# EAGLE schematic motor_controller (EAGLE 9.6.2)
AUTHOR: Mike Schmidt; GENERATION: pasta; TITLE: Motor Controller; VERSION: 05

## Sheet 1 of 4: Connectors and Input Filtering
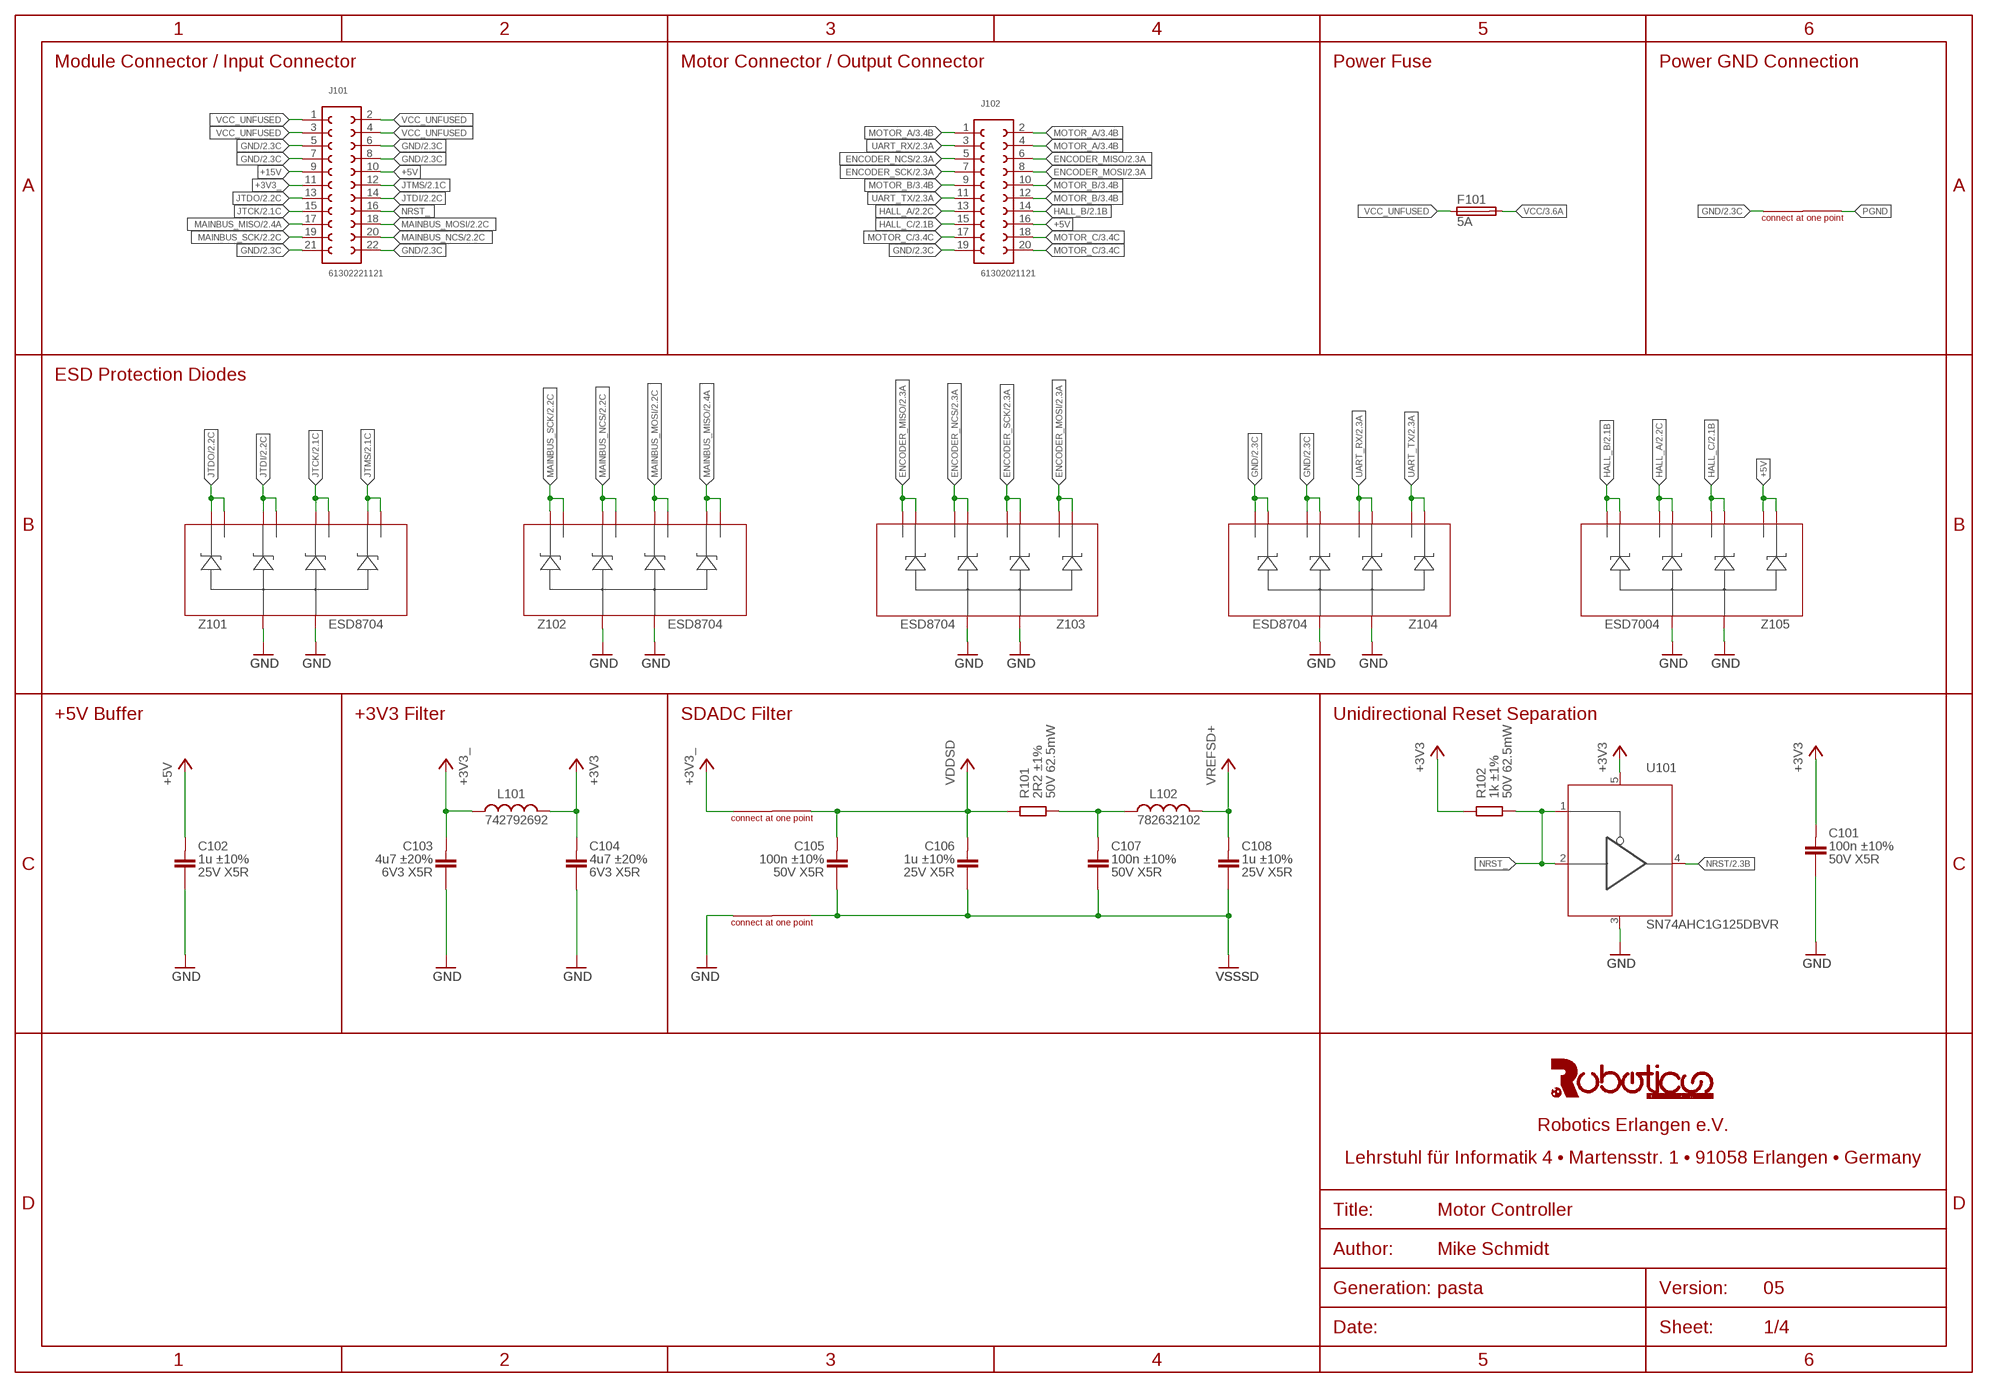
[diagram p0: schematic, sheet 1]

### Parts
C101  100n ±10% 50V X5R  C(100NF,50V,0402)  [C0402]
C102  1u ±10% 25V X5R  C(1.0UF,25V,0402)  [C0402]
C103  4u7 ±20% 6V3 X5R  C(4.7UF,6.3V,0603)  [C0603]
C104  4u7 ±20% 6V3 X5R  C(4.7UF,6.3V,0603)  [C0603]
C105  100n ±10% 50V X5R  C(100NF,50V,0402)  [C0402]
C106  1u ±10% 25V X5R  C(1.0UF,25V,0402)  [C0402]
C107  100n ±10% 50V X5R  C(100NF,50V,0402)  [C0402]
C108  1u ±10% 25V X5R  C(1.0UF,25V,0402)  [C0402]
F101  5A  0157005.DRT  [157T]
J101  61302221121  [HDRV22W64P254_2X11_2794X508X854B]
J102  61302021121  [61302021121]
L101  742792692  [WE-CBF_0603(W=2.6)]
L102  782632102  [WE-CBF_0603(W=2.6)]
R101  2R2 ±1% 50V 62.5mW  R(2.2R,50V,0.0625W,0402)  [R0402]
R102  1k ±1% 50V 62.5mW  R(1.0K,50V,0.0625W,0402)  [R0402]
SHORT101  SHORT4.35  [SHORT4.35]
SHORT102  SHORT2.4  [SHORT2.4]
SHORT103  SHORT2.4  [SHORT2.4]
U101  SN74AHC1G125DBVR  [SOT23-5]
Z101  ESD8704  [UDFN10]
Z102  ESD8704  [UDFN10]
Z103  ESD8704  [UDFN10]
Z104  ESD8704  [UDFN10]
Z105  ESD7004  [UDFN10]

### Nets
+3V3: C101.1 C104.1 L101.2 R102.1 U101.5(VCC) ; also sheet 2,3
+3V3_: C103.1 J101.11 L101.1 SHORT102.P2
+5V: C102.1 J101.10 J102.16 Z105.1(C1) Z105.10(D1)
+15V: J101.9
ENCODER_MISO: J102.6 Z103.5(C4) Z103.6(D4) ; also sheet 2
ENCODER_MOSI: J102.8 Z103.1(C1) Z103.10(D1) ; also sheet 2
ENCODER_NCS: J102.5 Z103.4(C3) Z103.7(D3) ; also sheet 2
ENCODER_SCK: J102.7 Z103.2(C2) Z103.9(D2) ; also sheet 2
GND: C101.2 C102.2 C103.2 C104.2 J101.5 J101.6 J101.7 J101.8 J101.21 J101.22 J102.19 SHORT101.P2 SHORT103.P2 U101.3(GND) Z101.3(A) Z101.8(A) Z102.3(A) Z102.8(A) Z103.3(A) Z103.8(A) Z104.3(A) Z104.4(C3) Z104.5(C4) Z104.6(D4) Z104.7(D3) Z104.8(A) Z105.3(A) Z105.8(A) ; also sheet 2,3
HALL_A: J102.13 Z105.4(C3) Z105.7(D3) ; also sheet 2,3
HALL_B: J102.14 Z105.5(C4) Z105.6(D4) ; also sheet 2,3
HALL_C: J102.15 Z105.2(C2) Z105.9(D2) ; also sheet 2,3
JTCK: J101.15 Z101.4(C3) Z101.7(D3) ; also sheet 2
JTDI: J101.14 Z101.2(C2) Z101.9(D2) ; also sheet 2
JTDO: J101.13 Z101.1(C1) Z101.10(D1) ; also sheet 2
JTMS: J101.12 Z101.5(C4) Z101.6(D4) ; also sheet 2
MAINBUS_MISO: J101.17 Z102.5(C4) Z102.6(D4) ; also sheet 2
MAINBUS_MOSI: J101.18 Z102.4(C3) Z102.7(D3) ; also sheet 2
MAINBUS_NCS: J101.20 Z102.2(C2) Z102.9(D2) ; also sheet 2
MAINBUS_SCK: J101.19 Z102.1(C1) Z102.10(D1) ; also sheet 2
MOTOR_A: J102.1 J102.2 J102.4 ; also sheet 3,4
MOTOR_B: J102.9 J102.10 J102.12 ; also sheet 3,4
MOTOR_C: J102.17 J102.18 J102.20 ; also sheet 3,4
N$2: C107.1 L102.1 R101.2
NRST: U101.4(O) ; also sheet 2
NRST_: J101.16 R102.2 U101.1(OE) U101.2(I)
PGND: SHORT101.P1 ; also sheet 3,4
UART_RX: J102.3 Z104.2(C2) Z104.9(D2) ; also sheet 2
UART_TX: J102.11 Z104.1(C1) Z104.10(D1) ; also sheet 2
VCC: F101.2 ; also sheet 3
VCC_UNFUSED: F101.1 J101.1 J101.2 J101.3 J101.4
VDDSD: C105.1 C106.1 R101.1 SHORT102.P1 ; also sheet 2,3
VREFSD+: C108.1 L102.2 ; also sheet 2
VSSSD: C105.2 C106.2 C107.2 C108.2 SHORT103.P1 ; also sheet 2,3

### Notes on the sheet
- Module Connector / Input Connector | Motor Connector / Output Connector | Power Fuse | Power GND Connection
- ESD Protection Diodes
- +5V Buffer | +3V3 Filter | SDADC Filter | Unidirectional Reset Separation

## Sheet 2 of 4: CPU and Logic
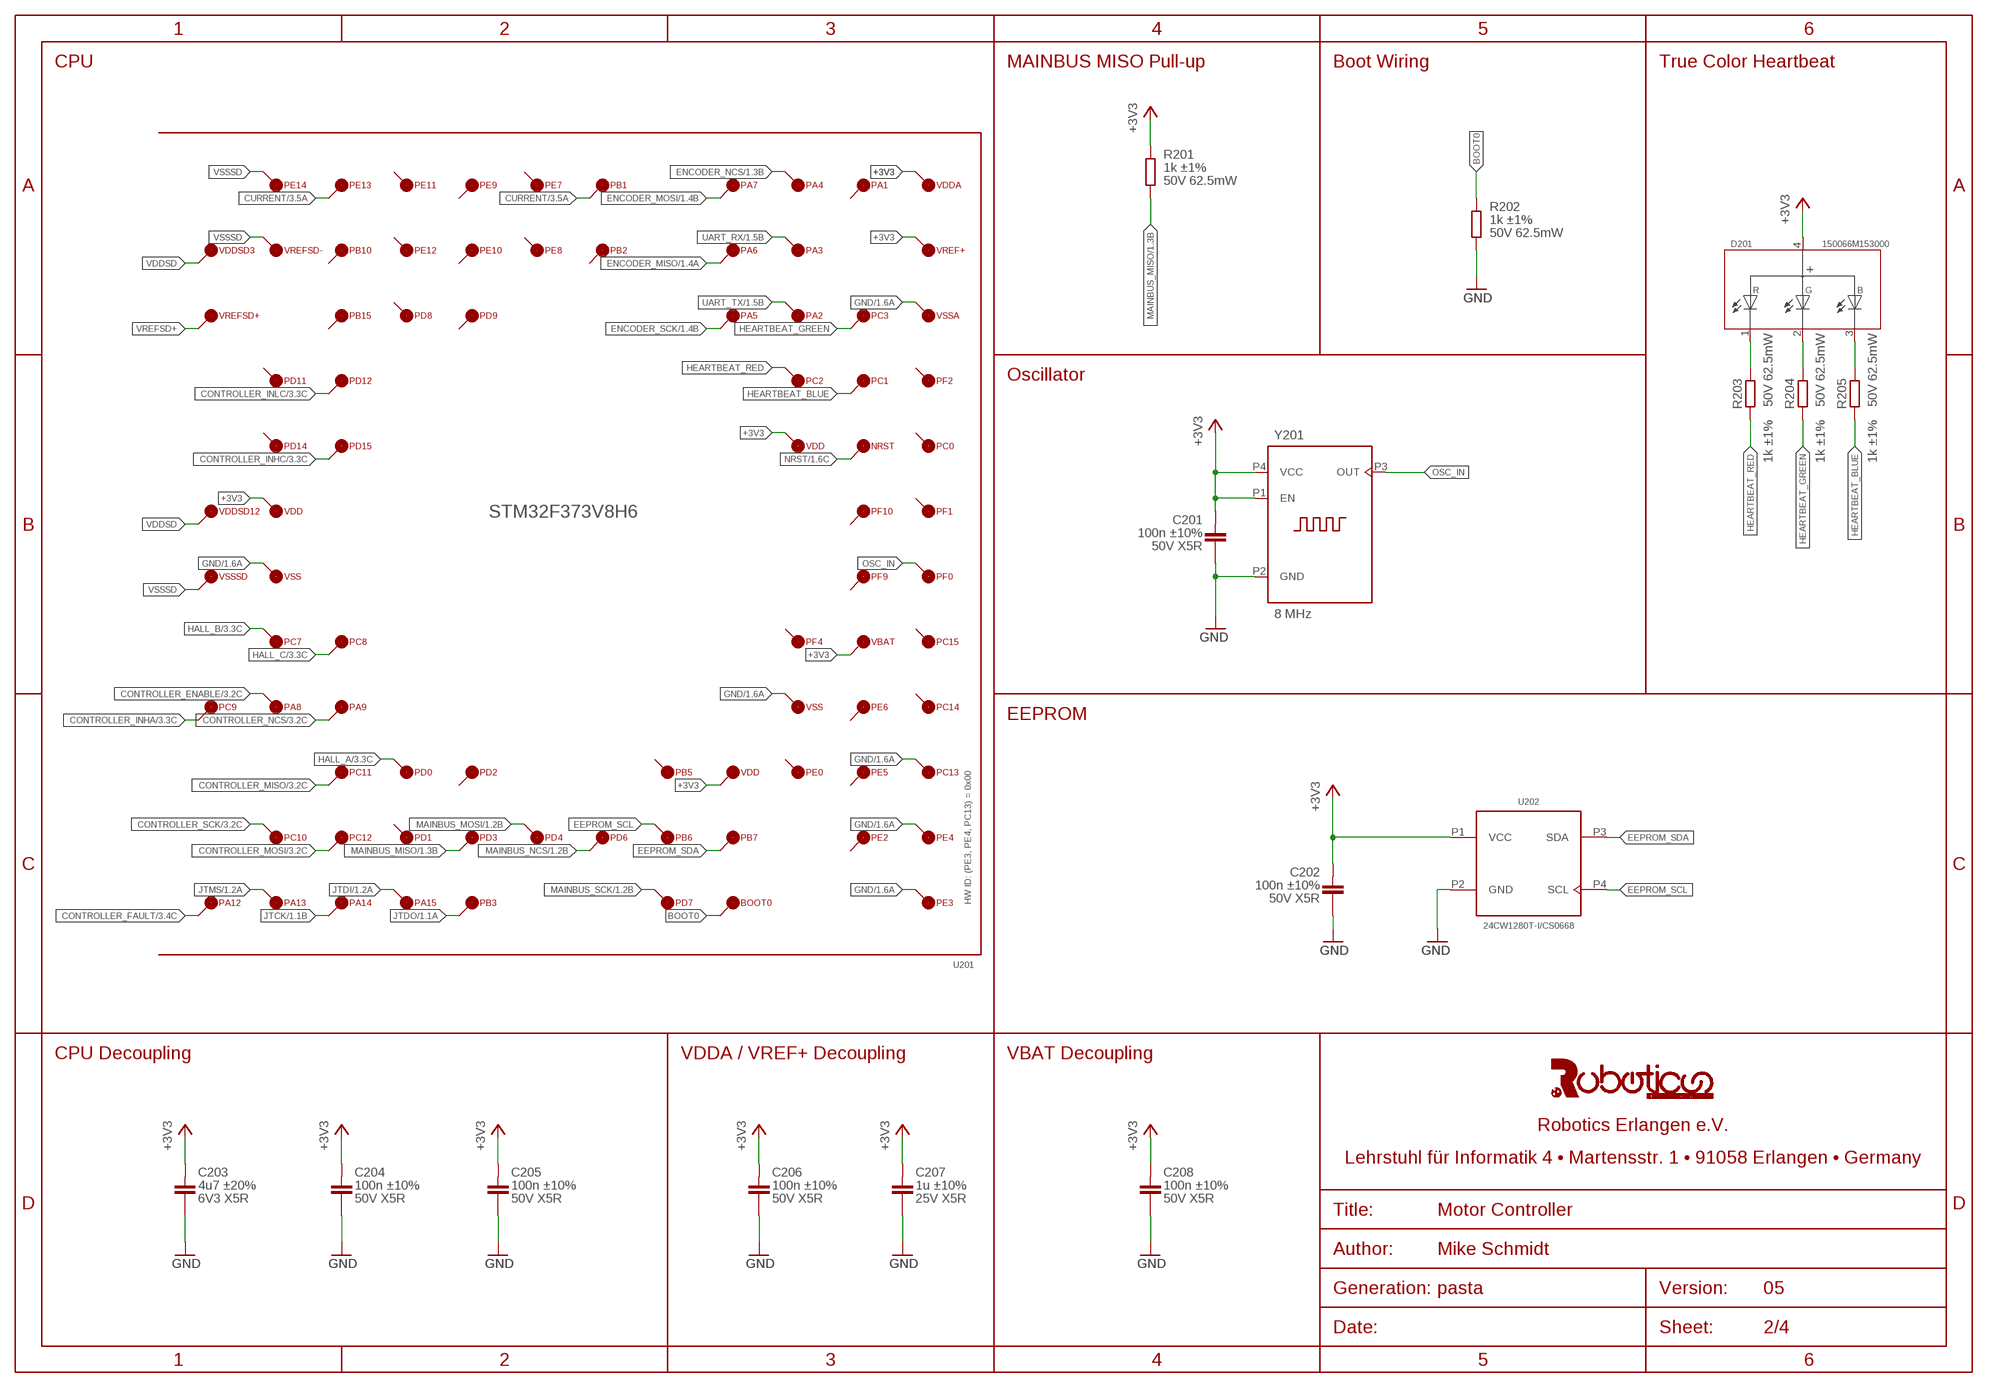
[diagram p1: schematic, sheet 2]

### Parts
C201  100n ±10% 50V X5R  C(100NF,50V,0402)  [C0402]
C202  100n ±10% 50V X5R  C(100NF,50V,0402)  [C0402]
C203  4u7 ±20% 6V3 X5R  C(4.7UF,6.3V,0603)  [C0603]
C204  100n ±10% 50V X5R  C(100NF,50V,0402)  [C0402]
C205  100n ±10% 50V X5R  C(100NF,50V,0402)  [C0402]
C206  100n ±10% 50V X5R  C(100NF,50V,0402)  [C0402]
C207  1u ±10% 25V X5R  C(1.0UF,25V,0402)  [C0402]
C208  100n ±10% 50V X5R  C(100NF,50V,0402)  [C0402]
D201  150066M153000  [WL-SFCX_0606]
R201  1k ±1% 50V 62.5mW  R(1.0K,50V,0.0625W,0402)  [R0402]
R202  1k ±1% 50V 62.5mW  R(1.0K,50V,0.0625W,0402)  [R0402]
R203  1k ±1% 50V 62.5mW  R(1.0K,50V,0.0625W,0402)  [R0402]
R204  1k ±1% 50V 62.5mW  R(1.0K,50V,0.0625W,0402)  [R0402]
R205  1k ±1% 50V 62.5mW  R(1.0K,50V,0.0625W,0402)  [R0402]
U201  STM32F373V8H6  [STM32F373V8H6]
U202  24CW1280T-I/CS0668  [CS0-4]
Y201  8 MHz  830207192009  [830207192009]

### Nets
+3V3: C201.1 C202.1 C203.1 C204.1 C205.1 C206.1 C207.1 C208.1 D201.4 R201.2 U201.VBAT U201.VDD@1(VDD) U201.VDD@2(VDD) U201.VDD@3(VDD) U201.VDDA U201.VREF+ U202.P1(VCC) Y201.P1(EN) Y201.P4(VCC) ; also sheet 1,3
BOOT0: R202.2 U201.BOOT0
CONTROLLER_ENABLE: U201.PA8 ; also sheet 3
CONTROLLER_FAULT: U201.PA12 ; also sheet 3
CONTROLLER_INHA: U201.PC9 ; also sheet 3
CONTROLLER_INHC: U201.PD15 ; also sheet 3
CONTROLLER_INLC: U201.PD12 ; also sheet 3
CONTROLLER_MISO: U201.PC11 ; also sheet 3
CONTROLLER_MOSI: U201.PC12 ; also sheet 3
CONTROLLER_NCS: U201.PA9 ; also sheet 3
CONTROLLER_SCK: U201.PC10 ; also sheet 3
CURRENT: U201.PB1 U201.PE13 ; also sheet 3
EEPROM_SCL: U201.PB6 U202.P4(SCL)
EEPROM_SDA: U201.PB7 U202.P3(SDA)
ENCODER_MISO: U201.PA6 ; also sheet 1
ENCODER_MOSI: U201.PA7 ; also sheet 1
ENCODER_NCS: U201.PA4 ; also sheet 1
ENCODER_SCK: U201.PA5 ; also sheet 1
GND: C201.2 C202.2 C203.2 C204.2 C205.2 C206.2 C207.2 C208.2 R202.1 U201.PC13 U201.PE3 U201.PE4 U201.VSS@1(VSS) U201.VSS@3(VSS) U201.VSSA U202.P2(GND) Y201.P2(GND) ; also sheet 1,3
HALL_A: U201.PD0 ; also sheet 1,3
HALL_B: U201.PC7 ; also sheet 1,3
HALL_C: U201.PC8 ; also sheet 1,3
HEARTBEAT_BLUE: R205.2 U201.PC1
HEARTBEAT_GREEN: R204.2 U201.PC3
HEARTBEAT_RED: R203.2 U201.PC2
JTCK: U201.PA14 ; also sheet 1
JTDI: U201.PA15 ; also sheet 1
JTDO: U201.PB3 ; also sheet 1
JTMS: U201.PA13 ; also sheet 1
MAINBUS_MISO: R201.1 U201.PD3 ; also sheet 1
MAINBUS_MOSI: U201.PD4 ; also sheet 1
MAINBUS_NCS: U201.PD6 ; also sheet 1
MAINBUS_SCK: U201.PD7 ; also sheet 1
N$10: D201.1(R) R203.1
N$21: D201.2(G) R204.1
N$23: D201.3(B) R205.1
NRST: U201.NRST ; also sheet 1
OSC_IN: U201.PF0 Y201.P3(OUT)
UART_RX: U201.PA3 ; also sheet 1
UART_TX: U201.PA2 ; also sheet 1
VDDSD: U201.VDDSD3 U201.VDDSD12 ; also sheet 1,3
VREFSD+: U201.VREFSD+ ; also sheet 1
VSSSD: U201.PE14 U201.VREFSD- U201.VSSSD ; also sheet 1,3
Unconnected: U201.PA1 U201.PB2 U201.PB5 U201.PB10 U201.PB15 U201.PC0 U201.PC14 U201.PC15 U201.PD1 U201.PD2 U201.PD8 U201.PD9 U201.PD11 U201.PD14 U201.PE0 U201.PE2 U201.PE5 U201.PE6 U201.PE7 U201.PE8 U201.PE9 U201.PE10 U201.PE11 U201.PE12 U201.PF1 U201.PF2 U201.PF4 U201.PF9 U201.PF10

### Notes on the sheet
- CPU | MAINBUS MISO Pull-up | Boot Wiring | True Color Heartbeat
- Oscillator
- EEPROM
- HW ID: (PE3, PE4, PC13) = 0x00
- CPU Decoupling | VDDA / VREF+ Decoupling | VBAT Decoupling

## Sheet 3 of 4: Motor Controller & Current Sense
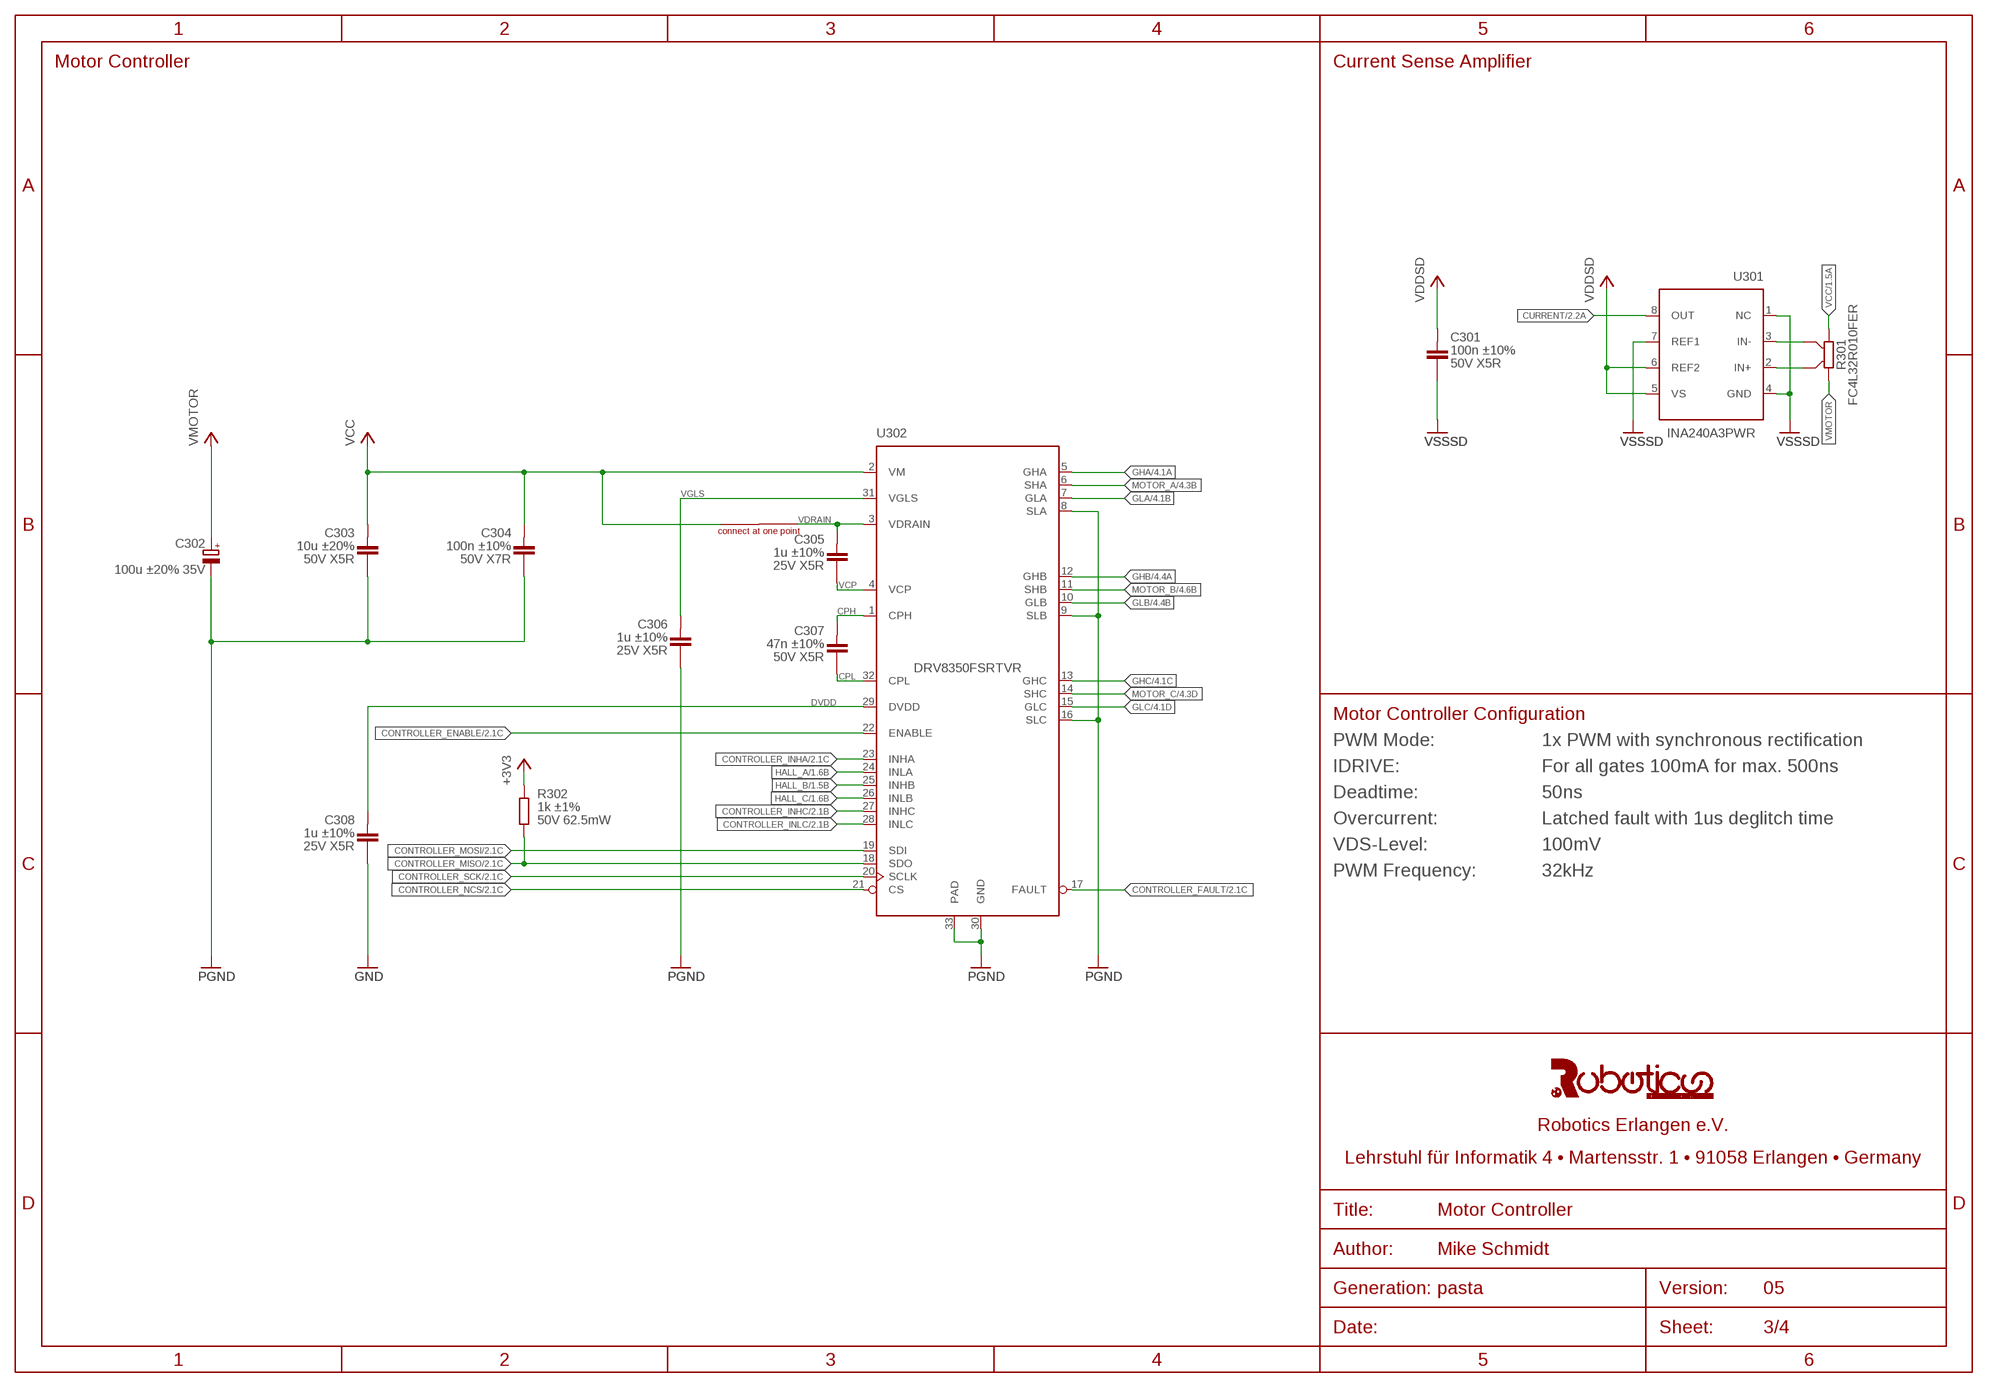
[diagram p2: schematic, sheet 3]

### Parts
C301  100n ±10% 50V X5R  C(100NF,50V,0402)  [C0402]
C302  100u ±20% 35V  865080545012  [865080545012]
C303  10u ±20% 50V X5R  C(10UF,50V,1206)  [C1206]
C304  100n ±10% 50V X7R  C(100NF,50V,0603)  [C0603]
C305  1u ±10% 25V X5R  C(1.0UF,25V,0402)  [C0402]
C306  1u ±10% 25V X5R  C(1.0UF,25V,0402)  [C0402]
C307  47n ±10% 50V X5R  C(47NF,50V,0402)  [C0402]
C308  1u ±10% 25V X5R  C(1.0UF,25V,0402)  [C0402]
R301  FC4L32R010FER  [FC4L32]
R302  1k ±1% 50V 62.5mW  R(1.0K,50V,0.0625W,0402)  [R0402]
SHORT301  SHORT2.4  [SHORT2.4]
U301  INA240A3PWR  [TSSOP-8]
U302  DRV8350FSRTVR  [QFN50P500X500X80-33T345]

### Nets
+3V3: R302.2 ; also sheet 1,2
CONTROLLER_ENABLE: U302.22(ENABLE) ; also sheet 2
CONTROLLER_FAULT: U302.17(FAULT) ; also sheet 2
CONTROLLER_INHA: U302.23(INHA) ; also sheet 2
CONTROLLER_INHC: U302.27(INHC) ; also sheet 2
CONTROLLER_INLC: U302.28(INLC) ; also sheet 2
CONTROLLER_MISO: R302.1 U302.18(SDO) ; also sheet 2
CONTROLLER_MOSI: U302.19(SDI) ; also sheet 2
CONTROLLER_NCS: U302.21(CS) ; also sheet 2
CONTROLLER_SCK: U302.20(SCLK) ; also sheet 2
CPH: C307.1 U302.1(CPH)
CPL: C307.2 U302.32(CPL)
CURRENT: U301.8(OUT) ; also sheet 2
DVDD: C308.1 U302.29(DVDD)
GHA: U302.5(GHA) ; also sheet 4
GHB: U302.12(GHB) ; also sheet 4
GHC: U302.13(GHC) ; also sheet 4
GLA: U302.7(GLA) ; also sheet 4
GLB: U302.10(GLB) ; also sheet 4
GLC: U302.15(GLC) ; also sheet 4
GND: C308.2 ; also sheet 1,2
HALL_A: U302.24(INLA) ; also sheet 1,2
HALL_B: U302.25(INHB) ; also sheet 1,2
HALL_C: U302.26(INLB) ; also sheet 1,2
MOTOR_A: U302.6(SHA) ; also sheet 1,4
MOTOR_B: U302.11(SHB) ; also sheet 1,4
MOTOR_C: U302.14(SHC) ; also sheet 1,4
N$1: R301.S1 U301.2(IN+)
N$3: R301.S2 U301.3(IN-)
PGND: C302.N(-) C303.2 C304.2 C306.2 U302.8(SLA) U302.9(SLB) U302.16(SLC) U302.30(GND) U302.33(PAD) ; also sheet 1,4
VCC: C303.1 C304.1 R301.P2 SHORT301.P1 U302.2(VM) ; also sheet 1
VCP: C305.2 U302.4(VCP)
VDDSD: C301.1 U301.5(VS) U301.6(REF2) ; also sheet 1,2
VDRAIN: C305.1 SHORT301.P2 U302.3(VDRAIN)
VGLS: C306.1 U302.31(VGLS)
VMOTOR: C302.P(+) R301.P1 ; also sheet 4
VSSSD: C301.2 U301.1(NC) U301.4(GND) U301.7(REF1) ; also sheet 1,2

### Notes on the sheet
- Motor Controller | Current Sense Amplifier
- Motor Controller Configuration
- PWM Mode: | 1x PWM with synchronous rectification
- IDRIVE: | For all gates 100mA for max. 500ns
- Deadtime: | 50ns
- Overcurrent: | Latched fault with 1us deglitch time
- VDS-Level: | 100mV
- PWM Frequency: | 32kHz

## Sheet 4 of 4
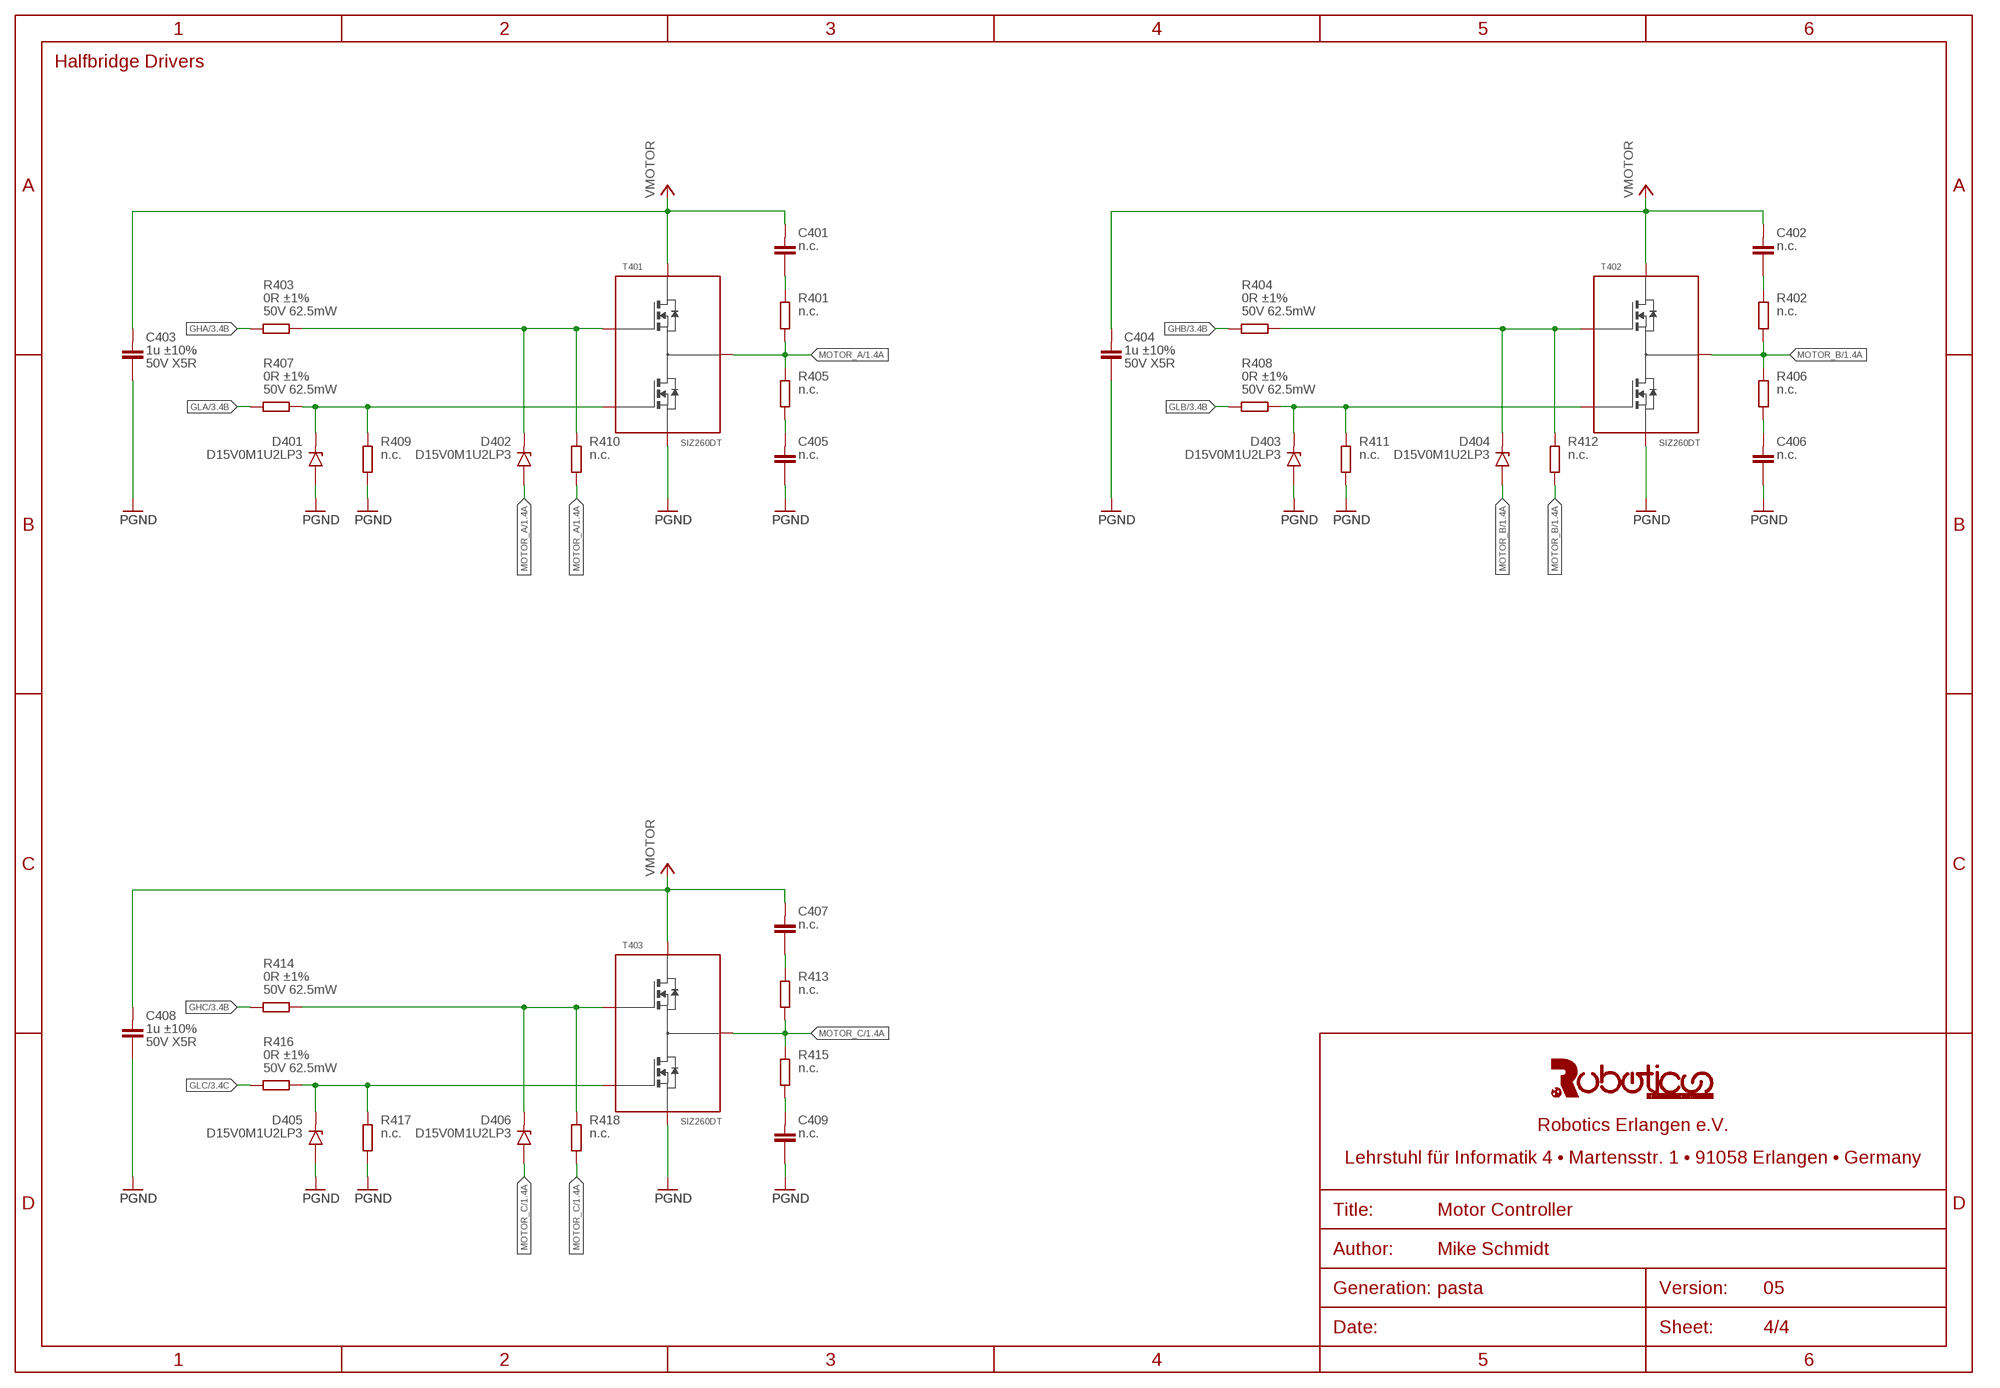
[diagram p3: schematic, sheet 4]

### Parts
C401  n.c.  C(N.C.,0402)  [C0402]
C402  n.c.  C(N.C.,0402)  [C0402]
C403  1u ±10% 50V X5R  C(1.0UF,50V,0603)  [C0603]
C404  1u ±10% 50V X5R  C(1.0UF,50V,0603)  [C0603]
C405  n.c.  C(N.C.,0402)  [C0402]
C406  n.c.  C(N.C.,0402)  [C0402]
C407  n.c.  C(N.C.,0402)  [C0402]
C408  1u ±10% 50V X5R  C(1.0UF,50V,0603)  [C0603]
C409  n.c.  C(N.C.,0402)  [C0402]
D401  D15V0M1U2LP3  [D15V0M1U2LP3]
D402  D15V0M1U2LP3  [D15V0M1U2LP3]
D403  D15V0M1U2LP3  [D15V0M1U2LP3]
D404  D15V0M1U2LP3  [D15V0M1U2LP3]
D405  D15V0M1U2LP3  [D15V0M1U2LP3]
D406  D15V0M1U2LP3  [D15V0M1U2LP3]
R401  n.c.  R(N.C.,0603)  [R0603]
R402  n.c.  R(N.C.,0603)  [R0603]
R403  0R ±1% 50V 62.5mW  R(0R,50V,0.0625W,0402)  [R0402]
R404  0R ±1% 50V 62.5mW  R(0R,50V,0.0625W,0402)  [R0402]
R405  n.c.  R(N.C.,0603)  [R0603]
R406  n.c.  R(N.C.,0603)  [R0603]
R407  0R ±1% 50V 62.5mW  R(0R,50V,0.0625W,0402)  [R0402]
R408  0R ±1% 50V 62.5mW  R(0R,50V,0.0625W,0402)  [R0402]
R409  n.c.  R(N.C.,0402)  [R0402]
R410  n.c.  R(N.C.,0402)  [R0402]
R411  n.c.  R(N.C.,0402)  [R0402]
R412  n.c.  R(N.C.,0402)  [R0402]
R413  n.c.  R(N.C.,0603)  [R0603]
R414  0R ±1% 50V 62.5mW  R(0R,50V,0.0625W,0402)  [R0402]
R415  n.c.  R(N.C.,0603)  [R0603]
R416  0R ±1% 50V 62.5mW  R(0R,50V,0.0625W,0402)  [R0402]
R417  n.c.  R(N.C.,0402)  [R0402]
R418  n.c.  R(N.C.,0402)  [R0402]
T401  SIZ260DT  [SIZ260DT]
T402  SIZ260DT  [SIZ260DT]
T403  SIZ260DT  [SIZ260DT]

### Nets
GHA: R403.2 ; also sheet 3
GHB: R404.2 ; also sheet 3
GHC: R414.2 ; also sheet 3
GLA: R407.2 ; also sheet 3
GLB: R408.2 ; also sheet 3
GLC: R416.2 ; also sheet 3
MOTOR_A: D402.P2(ANODE) R401.1 R405.2 R410.1 T401.P10(VSW) ; also sheet 1,3
MOTOR_B: D404.P2(ANODE) R402.1 R406.2 R412.1 T402.P10(VSW) ; also sheet 1,3
MOTOR_C: D406.P2(ANODE) R413.1 R415.2 R418.1 T403.P10(VSW) ; also sheet 1,3
N$5: C406.1 R406.1
N$7: D402.P1(KATHODE) R403.1 R410.2 T401.P1(GH)
N$8: C405.1 R405.1
N$9: C401.2 R401.2
N$11: C409.1 R415.1
N$12: D401.P1(KATHODE) R407.1 R409.2 T401.P8(GL)
N$13: C402.2 R402.2
N$14: D406.P1(KATHODE) R414.1 R418.2 T403.P1(GH)
N$15: D405.P1(KATHODE) R416.1 R417.2 T403.P8(GL)
N$16: C407.2 R413.2
N$17: D404.P1(KATHODE) R404.1 R412.2 T402.P1(GH)
N$18: D403.P1(KATHODE) R408.1 R411.2 T402.P8(GL)
PGND: C403.2 C404.2 C405.2 C406.2 C408.2 C409.2 D401.P2(ANODE) D403.P2(ANODE) D405.P2(ANODE) R409.1 R411.1 R417.1 T401.P5(PGND) T401.P6(PGND) T401.P7(PGND) T402.P5(PGND) T402.P6(PGND) T402.P7(PGND) T403.P5(PGND) T403.P6(PGND) T403.P7(PGND) ; also sheet 1,3
VMOTOR: C401.1 C402.1 C403.1 C404.1 C407.1 C408.1 T401.P2(VIN) T401.P3(VIN) T401.P4(VIN) T401.P9(VIN) T402.P2(VIN) T402.P3(VIN) T402.P4(VIN) T402.P9(VIN) T403.P2(VIN) T403.P3(VIN) T403.P4(VIN) T403.P9(VIN) ; also sheet 3

### Notes on the sheet
- Halfbridge Drivers

## Library data of the parts
C101 C105 C107 C201 C202 C204-C206 C208 C301 = capacitors:C(*?): Robotics Erlangen Capacitor Library This library provides a list of predefined capacitors with the following features: It is guaranteed that the capacitor exists with the given value, voltage rating and package size If you choose the capacitor you need (e.g. 2u2 with at least 50V) the package will be automatically choosen The manufacturer's data is automatically added so that exactly that capacitor will be ordered The value of the capacitor will be automatically filled with the most relevant data To choose a capacitor, you need to think about the voltage it must be rated for acc. to your application. Use below table to get a minimum voltage rating for the capacitor, depending on the maximum voltage that will be applied to it in your application. Maximum Voltage Applied Notes Minimum Voltage Rating ≤ 3.3V ≥ 6V3 ≤ 5.0V ≥ 10V ≤ 16.8V ≥ 25V ≤ 33.6V Includes all signals that are at max. VCC ≥ 50V After you determined the minimum voltage rating of the capacitor, search for it in the database of this library and choose the first one, that has at least that rating. The library is primarily sorted by capacitance values. Never change the value of predefined capacitors! Note: If your project requires a very specific capacitor (e.g. low tolerance, high voltage or E-24 upwards), then choose any of the predefined empty devices C(0402), C(0603), C(0805), C(1206), C(1210), or C(1812). Always set the attributes MF, MPN and VALUE for custom capacitors!; CAPACITANCE: 100n; DIELECTRIC: X5R; LINE1: 100n ±10%; LINE2: 50V X5R; MF: Murata Electronics; MPN: GRM155R61H104KE14J; TOLERANCE: ±10%; VOLTAGE: 50V
C102 C106 C108 C207 C305 C306 C308 = capacitors:C(*?): Robotics Erlangen Capacitor Library This library provides a list of predefined capacitors with the following features: It is guaranteed that the capacitor exists with the given value, voltage rating and package size If you choose the capacitor you need (e.g. 2u2 with at least 50V) the package will be automatically choosen The manufacturer's data is automatically added so that exactly that capacitor will be ordered The value of the capacitor will be automatically filled with the most relevant data To choose a capacitor, you need to think about the voltage it must be rated for acc. to your application. Use below table to get a minimum voltage rating for the capacitor, depending on the maximum voltage that will be applied to it in your application. Maximum Voltage Applied Notes Minimum Voltage Rating ≤ 3.3V ≥ 6V3 ≤ 5.0V ≥ 10V ≤ 16.8V ≥ 25V ≤ 33.6V Includes all signals that are at max. VCC ≥ 50V After you determined the minimum voltage rating of the capacitor, search for it in the database of this library and choose the first one, that has at least that rating. The library is primarily sorted by capacitance values. Never change the value of predefined capacitors! Note: If your project requires a very specific capacitor (e.g. low tolerance, high voltage or E-24 upwards), then choose any of the predefined empty devices C(0402), C(0603), C(0805), C(1206), C(1210), or C(1812). Always set the attributes MF, MPN and VALUE for custom capacitors!; CAPACITANCE: 1u; DIELECTRIC: X5R; LINE1: 1u ±10%; LINE2: 25V X5R; MF: Murata Electronics; MPN: GRM155R61E105KA12D; TOLERANCE: ±10%; VOLTAGE: 25V
C103 C104 C203 = capacitors:C(*?): Robotics Erlangen Capacitor Library This library provides a list of predefined capacitors with the following features: It is guaranteed that the capacitor exists with the given value, voltage rating and package size If you choose the capacitor you need (e.g. 2u2 with at least 50V) the package will be automatically choosen The manufacturer's data is automatically added so that exactly that capacitor will be ordered The value of the capacitor will be automatically filled with the most relevant data To choose a capacitor, you need to think about the voltage it must be rated for acc. to your application. Use below table to get a minimum voltage rating for the capacitor, depending on the maximum voltage that will be applied to it in your application. Maximum Voltage Applied Notes Minimum Voltage Rating ≤ 3.3V ≥ 6V3 ≤ 5.0V ≥ 10V ≤ 16.8V ≥ 25V ≤ 33.6V Includes all signals that are at max. VCC ≥ 50V After you determined the minimum voltage rating of the capacitor, search for it in the database of this library and choose the first one, that has at least that rating. The library is primarily sorted by capacitance values. Never change the value of predefined capacitors! Note: If your project requires a very specific capacitor (e.g. low tolerance, high voltage or E-24 upwards), then choose any of the predefined empty devices C(0402), C(0603), C(0805), C(1206), C(1210), or C(1812). Always set the attributes MF, MPN and VALUE for custom capacitors!; CAPACITANCE: 4u7; DIELECTRIC: X5R; LINE1: 4u7 ±20%; LINE2: 6V3 X5R; MF: Würth Elektronik; MPN: 885012106005; TOLERANCE: ±20%; VOLTAGE: 6V3
C302 = motor_controller:865080545012; MF: Würth Elektronik; MPN: 865080545012
C303 = capacitors:C(*?): Robotics Erlangen Capacitor Library This library provides a list of predefined capacitors with the following features: It is guaranteed that the capacitor exists with the given value, voltage rating and package size If you choose the capacitor you need (e.g. 2u2 with at least 50V) the package will be automatically choosen The manufacturer's data is automatically added so that exactly that capacitor will be ordered The value of the capacitor will be automatically filled with the most relevant data To choose a capacitor, you need to think about the voltage it must be rated for acc. to your application. Use below table to get a minimum voltage rating for the capacitor, depending on the maximum voltage that will be applied to it in your application. Maximum Voltage Applied Notes Minimum Voltage Rating ≤ 3.3V ≥ 6V3 ≤ 5.0V ≥ 10V ≤ 16.8V ≥ 25V ≤ 33.6V Includes all signals that are at max. VCC ≥ 50V After you determined the minimum voltage rating of the capacitor, search for it in the database of this library and choose the first one, that has at least that rating. The library is primarily sorted by capacitance values. Never change the value of predefined capacitors! Note: If your project requires a very specific capacitor (e.g. low tolerance, high voltage or E-24 upwards), then choose any of the predefined empty devices C(0402), C(0603), C(0805), C(1206), C(1210), or C(1812). Always set the attributes MF, MPN and VALUE for custom capacitors!; CAPACITANCE: 10u; DIELECTRIC: X5R; LINE1: 10u ±20%; LINE2: 50V X5R; MF: Samsung; MPN: CL31A106MBHNNNE; TOLERANCE: ±20%; VOLTAGE: 50V
C304 = capacitors:C(*?): Robotics Erlangen Capacitor Library This library provides a list of predefined capacitors with the following features: It is guaranteed that the capacitor exists with the given value, voltage rating and package size If you choose the capacitor you need (e.g. 2u2 with at least 50V) the package will be automatically choosen The manufacturer's data is automatically added so that exactly that capacitor will be ordered The value of the capacitor will be automatically filled with the most relevant data To choose a capacitor, you need to think about the voltage it must be rated for acc. to your application. Use below table to get a minimum voltage rating for the capacitor, depending on the maximum voltage that will be applied to it in your application. Maximum Voltage Applied Notes Minimum Voltage Rating ≤ 3.3V ≥ 6V3 ≤ 5.0V ≥ 10V ≤ 16.8V ≥ 25V ≤ 33.6V Includes all signals that are at max. VCC ≥ 50V After you determined the minimum voltage rating of the capacitor, search for it in the database of this library and choose the first one, that has at least that rating. The library is primarily sorted by capacitance values. Never change the value of predefined capacitors! Note: If your project requires a very specific capacitor (e.g. low tolerance, high voltage or E-24 upwards), then choose any of the predefined empty devices C(0402), C(0603), C(0805), C(1206), C(1210), or C(1812). Always set the attributes MF, MPN and VALUE for custom capacitors!; CAPACITANCE: 100n; DIELECTRIC: X7R; LINE1: 100n ±10%; LINE2: 50V X7R; MF: Würth Elektronik; MPN: 885012206095; TOLERANCE: ±10%; VOLTAGE: 50V
C307 = capacitors:C(*?): Robotics Erlangen Capacitor Library This library provides a list of predefined capacitors with the following features: It is guaranteed that the capacitor exists with the given value, voltage rating and package size If you choose the capacitor you need (e.g. 2u2 with at least 50V) the package will be automatically choosen The manufacturer's data is automatically added so that exactly that capacitor will be ordered The value of the capacitor will be automatically filled with the most relevant data To choose a capacitor, you need to think about the voltage it must be rated for acc. to your application. Use below table to get a minimum voltage rating for the capacitor, depending on the maximum voltage that will be applied to it in your application. Maximum Voltage Applied Notes Minimum Voltage Rating ≤ 3.3V ≥ 6V3 ≤ 5.0V ≥ 10V ≤ 16.8V ≥ 25V ≤ 33.6V Includes all signals that are at max. VCC ≥ 50V After you determined the minimum voltage rating of the capacitor, search for it in the database of this library and choose the first one, that has at least that rating. The library is primarily sorted by capacitance values. Never change the value of predefined capacitors! Note: If your project requires a very specific capacitor (e.g. low tolerance, high voltage or E-24 upwards), then choose any of the predefined empty devices C(0402), C(0603), C(0805), C(1206), C(1210), or C(1812). Always set the attributes MF, MPN and VALUE for custom capacitors!; CAPACITANCE: 47n; DIELECTRIC: X5R; LINE1: 47n ±10%; LINE2: 50V X5R; MF: Murata Electronics; MPN: GRM155R61H473KE14D; TOLERANCE: ±10%; VOLTAGE: 50V
C401 C402 C405-C407 C409 = capacitors:C(*?): Robotics Erlangen Capacitor Library This library provides a list of predefined capacitors with the following features: It is guaranteed that the capacitor exists with the given value, voltage rating and package size If you choose the capacitor you need (e.g. 2u2 with at least 50V) the package will be automatically choosen The manufacturer's data is automatically added so that exactly that capacitor will be ordered The value of the capacitor will be automatically filled with the most relevant data To choose a capacitor, you need to think about the voltage it must be rated for acc. to your application. Use below table to get a minimum voltage rating for the capacitor, depending on the maximum voltage that will be applied to it in your application. Maximum Voltage Applied Notes Minimum Voltage Rating ≤ 3.3V ≥ 6V3 ≤ 5.0V ≥ 10V ≤ 16.8V ≥ 25V ≤ 33.6V Includes all signals that are at max. VCC ≥ 50V After you determined the minimum voltage rating of the capacitor, search for it in the database of this library and choose the first one, that has at least that rating. The library is primarily sorted by capacitance values. Never change the value of predefined capacitors! Note: If your project requires a very specific capacitor (e.g. low tolerance, high voltage or E-24 upwards), then choose any of the predefined empty devices C(0402), C(0603), C(0805), C(1206), C(1210), or C(1812). Always set the attributes MF, MPN and VALUE for custom capacitors!; CAPACITANCE: n.c.; LINE1: n.c.
C403 C404 C408 = capacitors:C(*?): Robotics Erlangen Capacitor Library This library provides a list of predefined capacitors with the following features: It is guaranteed that the capacitor exists with the given value, voltage rating and package size If you choose the capacitor you need (e.g. 2u2 with at least 50V) the package will be automatically choosen The manufacturer's data is automatically added so that exactly that capacitor will be ordered The value of the capacitor will be automatically filled with the most relevant data To choose a capacitor, you need to think about the voltage it must be rated for acc. to your application. Use below table to get a minimum voltage rating for the capacitor, depending on the maximum voltage that will be applied to it in your application. Maximum Voltage Applied Notes Minimum Voltage Rating ≤ 3.3V ≥ 6V3 ≤ 5.0V ≥ 10V ≤ 16.8V ≥ 25V ≤ 33.6V Includes all signals that are at max. VCC ≥ 50V After you determined the minimum voltage rating of the capacitor, search for it in the database of this library and choose the first one, that has at least that rating. The library is primarily sorted by capacitance values. Never change the value of predefined capacitors! Note: If your project requires a very specific capacitor (e.g. low tolerance, high voltage or E-24 upwards), then choose any of the predefined empty devices C(0402), C(0603), C(0805), C(1206), C(1210), or C(1812). Always set the attributes MF, MPN and VALUE for custom capacitors!; CAPACITANCE: 1u; DIELECTRIC: X5R; LINE1: 1u ±10%; LINE2: 50V X5R; MF: Samsung; MPN: CL10A105KB8NNNC; TOLERANCE: ±10%; VOLTAGE: 50V
D201 = motor_controller:150066M153000: WL-SFCD SMD Full-color Chip LED Diffused Details see: http://katalog.we-online.de/en/led/WL-SFCD Created By Yingchun,Shan 2016 (C) Wurth Elektronik; MF: Würth Elektronik; MPN: 150066M153000
D401-D406 = motor_controller:D15V0M1U2LP3; MF: Diodes Incorporated; MOUSER: 621-D15V0M1U2LP3-7; MPN: D15V0M1U2LP3-7
F101 = motor_controller:0157*DRT: 157T Series - Standard Nano2® Fuse and Clip Assembly Description The 157T Series Fuse/Clip assembly is a small, square, Time-Lag, surface mount fuse that is assembled in surface mountable fuse clips. The unique time delay feature of this fuse design helps solve the problem of nuisance “opening” by accommodating inrush currents that normally cause a fast acting fuse to open. The fuse clip and pre-installed fuse combination can be automatically placed in PC Board in one efficient manufacturing operation. It permits quick and easy replacement of fuses without performing desoldering process, even in the field and without exposing the PC Board to detrimental effects of rework solder heat. Features Surface-Mountable, Time-Lag Fuse. Fully compatible with RoHS/Pb-Free solder alloys and higher temperature profiles associated with leadfree assembly Easily replaceable on PC Board (Field Replaceable) RoHS Compliant and Halogen-free Available in ratings of 0.375 ~ 5 Amperes Applications Instrumentations Base Stations Telecommunications Additional Information Datasheet <http://www.littelfuse.com/~/media/electronics/datasheets/fuses/littelfuse_fuse_157t_datasheet.pdf.pdf> Resources <http://www.littelfuse.com/products/fuse-blocks-fuseholders-and-fuse-accessories/fuse-clips/157t.aspx#TechnicalResources> Samples <http://www.littelfuse.com/products/fuse-blocks-fuseholders-and-fuse-accessories/fuse-clips/157t.aspx#ElectricalCharacteristics>; MF: Littelfuse; MOUSER: 576-0157005.DRT; MPN: 0157005.DRT
J101 = motor_controller:61302221121; MF: Würth Elektronik; MPN: 61302221121
J102 = motor_controller:61302021121: WR-PHD 2.54mm Dual Pin Header, 20 Pins =>Code : Con_BTB_PHD_2.54_2_61302021121 Details see: http://katalog.we-online.de/en/em/613_0xx_211_21 Created 2014-05-29, Karrer Zheng 2014 (C) Würth Elektronik; MF: Würth Elektronik; MPN: 61302021121
L101 = motor_controller:742792: WE-CBF SMD EMI Suppression Ferrite Bead Characteristics Reliable Ni-Sn electrodes High rated current up to 6 A Operating temperature: –55 ºC to +125 ºC Applications Perfect as data lined filter and for uncoupling of distribution voltage Package name and Variant abbreviation: Package: Wide Band /High Speed: W=Width= 2.2 High Current: W=Width= 2.6 Variant abbreviation: WB = Wide Band HS=High Speed HC=High Current Details see: http://katalog.we-online.de/en/pbs/WE-CBF Updated by Ella Wu 2019-01-02 2019 (C) Wurth Elektronik; MF: Würth Elektronik; MPN: 742792692
L102 = motor_controller:782632: WE-CBF SMD EMI Suppression Ferrite Bead Characteristics Reliable Ni-Sn electrodes High rated current up to 6 A Operating temperature: –55 ºC to +125 ºC Applications Perfect as data lined filter and for uncoupling of distribution voltage Package name and Variant abbreviation: Package: Wide Band /High Speed: W=Width= 2.2 High Current: W=Width= 2.6 Variant abbreviation: WB = Wide Band HS=High Speed HC=High Current Details see: http://katalog.we-online.de/en/pbs/WE-CBF Updated by Ella Wu 2019-01-02 2019 (C) Wurth Elektronik; MF: Würth Elektronik; MPN: 782632102
R101 = resistors:R(*?): Robotics Erlangen Resistor Library This library provides a list of predefined resistors with the following features: It is guaranteed that the resistor exists with the given value, voltage rating and package size If you choose the resistor you need (e.g. 10k with at least 75V and 0.1W) the package will be automatically choosen The manufacturer's data is automatically added so that exactly that resistor will be ordered The value of the resistor will be automatically filled with the most relevant data To choose a resistor, you have to determine the maximum operating voltage and power dissipation that will be applied to that resistor in your design. With these two values you can choose the minimum package acc. to below table, which lists the maximum operating voltage and power dissipation for each package. Always try to use a package with a voltage rating of at least twice your max. operating voltage and always keep a little marging between your power dissipation and the maximum power dissipation of the package (although typically, resistors can be overloaded by a factor of five for a short time period, i.e. less than a second). Package Maximum Operating Voltage Maximum Power Dissipation 0402 ≤ 50V ≤ 62.5 mW 0603 ≤ 75V ≤ 100 mW 0805 ≤ 150V ≤ 125 mW 1206 ≤ 200V ≤ 250 mW 1210 ≤ 200V ≤ 500 mW 2512 ≤ 200V ≤ 1 W Note: If your project requires a very specific resistor (e.g. low tolerance, high voltage / power dissipation or E-24 upwards), then choose any of the predefined empty devices R(0402), R(0603), R(0805), R(1206), R(1210), or R(2512). Always set the attributes MF, MPN and VALUE for custom resistors! Never change the value of non-custom resistors!; LINE1: 2R2 ±1%; LINE2: 50V 62.5mW; MF: YAGEO; MPN: RC0402FR-072R2L; POWER: 62.5mW; RESISTANCE: 2R2; TOLERANCE: ±1%; VOLTAGE: 50V
R102 R201-R205 R302 = resistors:R(*?): Robotics Erlangen Resistor Library This library provides a list of predefined resistors with the following features: It is guaranteed that the resistor exists with the given value, voltage rating and package size If you choose the resistor you need (e.g. 10k with at least 75V and 0.1W) the package will be automatically choosen The manufacturer's data is automatically added so that exactly that resistor will be ordered The value of the resistor will be automatically filled with the most relevant data To choose a resistor, you have to determine the maximum operating voltage and power dissipation that will be applied to that resistor in your design. With these two values you can choose the minimum package acc. to below table, which lists the maximum operating voltage and power dissipation for each package. Always try to use a package with a voltage rating of at least twice your max. operating voltage and always keep a little marging between your power dissipation and the maximum power dissipation of the package (although typically, resistors can be overloaded by a factor of five for a short time period, i.e. less than a second). Package Maximum Operating Voltage Maximum Power Dissipation 0402 ≤ 50V ≤ 62.5 mW 0603 ≤ 75V ≤ 100 mW 0805 ≤ 150V ≤ 125 mW 1206 ≤ 200V ≤ 250 mW 1210 ≤ 200V ≤ 500 mW 2512 ≤ 200V ≤ 1 W Note: If your project requires a very specific resistor (e.g. low tolerance, high voltage / power dissipation or E-24 upwards), then choose any of the predefined empty devices R(0402), R(0603), R(0805), R(1206), R(1210), or R(2512). Always set the attributes MF, MPN and VALUE for custom resistors! Never change the value of non-custom resistors!; LINE1: 1k ±1%; LINE2: 50V 62.5mW; MF: YAGEO; MPN: RC0402FR-071KL; POWER: 62.5mW; RESISTANCE: 1k; TOLERANCE: ±1%; VOLTAGE: 50V
R301 = motor_controller:FC4; MF: Ohmite; MOUSER: 588-FC4L32R010FER; MPN: FC4L32R010FER
R401 R402 R405 R406 R409-R413 R415 R417 R418 = resistors:R(*?): Robotics Erlangen Resistor Library This library provides a list of predefined resistors with the following features: It is guaranteed that the resistor exists with the given value, voltage rating and package size If you choose the resistor you need (e.g. 10k with at least 75V and 0.1W) the package will be automatically choosen The manufacturer's data is automatically added so that exactly that resistor will be ordered The value of the resistor will be automatically filled with the most relevant data To choose a resistor, you have to determine the maximum operating voltage and power dissipation that will be applied to that resistor in your design. With these two values you can choose the minimum package acc. to below table, which lists the maximum operating voltage and power dissipation for each package. Always try to use a package with a voltage rating of at least twice your max. operating voltage and always keep a little marging between your power dissipation and the maximum power dissipation of the package (although typically, resistors can be overloaded by a factor of five for a short time period, i.e. less than a second). Package Maximum Operating Voltage Maximum Power Dissipation 0402 ≤ 50V ≤ 62.5 mW 0603 ≤ 75V ≤ 100 mW 0805 ≤ 150V ≤ 125 mW 1206 ≤ 200V ≤ 250 mW 1210 ≤ 200V ≤ 500 mW 2512 ≤ 200V ≤ 1 W Note: If your project requires a very specific resistor (e.g. low tolerance, high voltage / power dissipation or E-24 upwards), then choose any of the predefined empty devices R(0402), R(0603), R(0805), R(1206), R(1210), or R(2512). Always set the attributes MF, MPN and VALUE for custom resistors! Never change the value of non-custom resistors!; LINE1: n.c.; RESISTANCE: n.c.
R403 R404 R407 R408 R414 R416 = resistors:R(*?): Robotics Erlangen Resistor Library This library provides a list of predefined resistors with the following features: It is guaranteed that the resistor exists with the given value, voltage rating and package size If you choose the resistor you need (e.g. 10k with at least 75V and 0.1W) the package will be automatically choosen The manufacturer's data is automatically added so that exactly that resistor will be ordered The value of the resistor will be automatically filled with the most relevant data To choose a resistor, you have to determine the maximum operating voltage and power dissipation that will be applied to that resistor in your design. With these two values you can choose the minimum package acc. to below table, which lists the maximum operating voltage and power dissipation for each package. Always try to use a package with a voltage rating of at least twice your max. operating voltage and always keep a little marging between your power dissipation and the maximum power dissipation of the package (although typically, resistors can be overloaded by a factor of five for a short time period, i.e. less than a second). Package Maximum Operating Voltage Maximum Power Dissipation 0402 ≤ 50V ≤ 62.5 mW 0603 ≤ 75V ≤ 100 mW 0805 ≤ 150V ≤ 125 mW 1206 ≤ 200V ≤ 250 mW 1210 ≤ 200V ≤ 500 mW 2512 ≤ 200V ≤ 1 W Note: If your project requires a very specific resistor (e.g. low tolerance, high voltage / power dissipation or E-24 upwards), then choose any of the predefined empty devices R(0402), R(0603), R(0805), R(1206), R(1210), or R(2512). Always set the attributes MF, MPN and VALUE for custom resistors! Never change the value of non-custom resistors!; LINE1: 0R ±1%; LINE2: 50V 62.5mW; MF: YAGEO; MPN: RC0402FR-070RL; POWER: 62.5mW; RESISTANCE: 0R; TOLERANCE: ±1%; VOLTAGE: 50V
SHORT101-SHORT103 SHORT301 = motor_controller:SHORT
T401-T403 = motor_controller:SIZ260DT; MF: Vishay; MOUSER: 78-SIZ260DT-T1-GE3; MPN: SIZ260DT-T1-GE3
U101 = motor_controller:SN74AHC1G125DBV; MF: Texas Instruments; MOUSER: 595-SN74AHC1G125DBVR; MPN: SN74AHC1G125DBVR
U201 = motor_controller:STM32F373V8H6; DIGIKEY: 497-13300-ND; FARNELL: 2333278; MF: STMicroelectronics; MOUSER: 511-STM32F373V8H6; MPN: STM32F373V8H6; RS-ONLINE: 795-7613
U202 = motor_controller:24CW*/?; MF: Microchip Technology; MOUSER: 579-CW1280T-I/CS0668; MPN: 24CW1280T-I/CS0668
U301 = motor_controller:INA240A*?R; MF: Texas Instruments; MOUSER: 595-INA240A3PWR; MPN: INA240A3PWR
U302 = motor_controller:DRV8350FS?*; MF: Texas Instruments; MPN: DRV8350FSRTVR
Y201 = motor_controller:83020*09; MF: Würth Elektronik; MPN: 830207192009
Z101-Z104 = motor_controller:ESD8704; MF: ON Semiconductor; MOUSER: 863-ESD8704MUTAG; MPN: ESD8704MUTAG
Z105 = motor_controller:ESD7004; MF: ON Semiconductor; MOUSER: 863-ESD7004MUTAG; MPN: ESD7004MUTAG

## Net classes
0 default: width 0.1 mm, drill 0.2 mm, clearance 0.1 mm